# Altium schematic sheet fpga-bank6-outside.SchDoc: FPGA - Bank 6
size Letter; CheckedBy: E. Chiu; CompanyName: Brinton Engineering, LLC; DrawnBy: J. Brinton; Engineer: J. Brinton; Address1: 3479 Edison Way; Address2: Menlo Park CA 94025; Address3: +1 (877) 778-8435; Address4: brintonengineering.com; Revision: 1; SheetNumber: 13; SheetTotal: 48
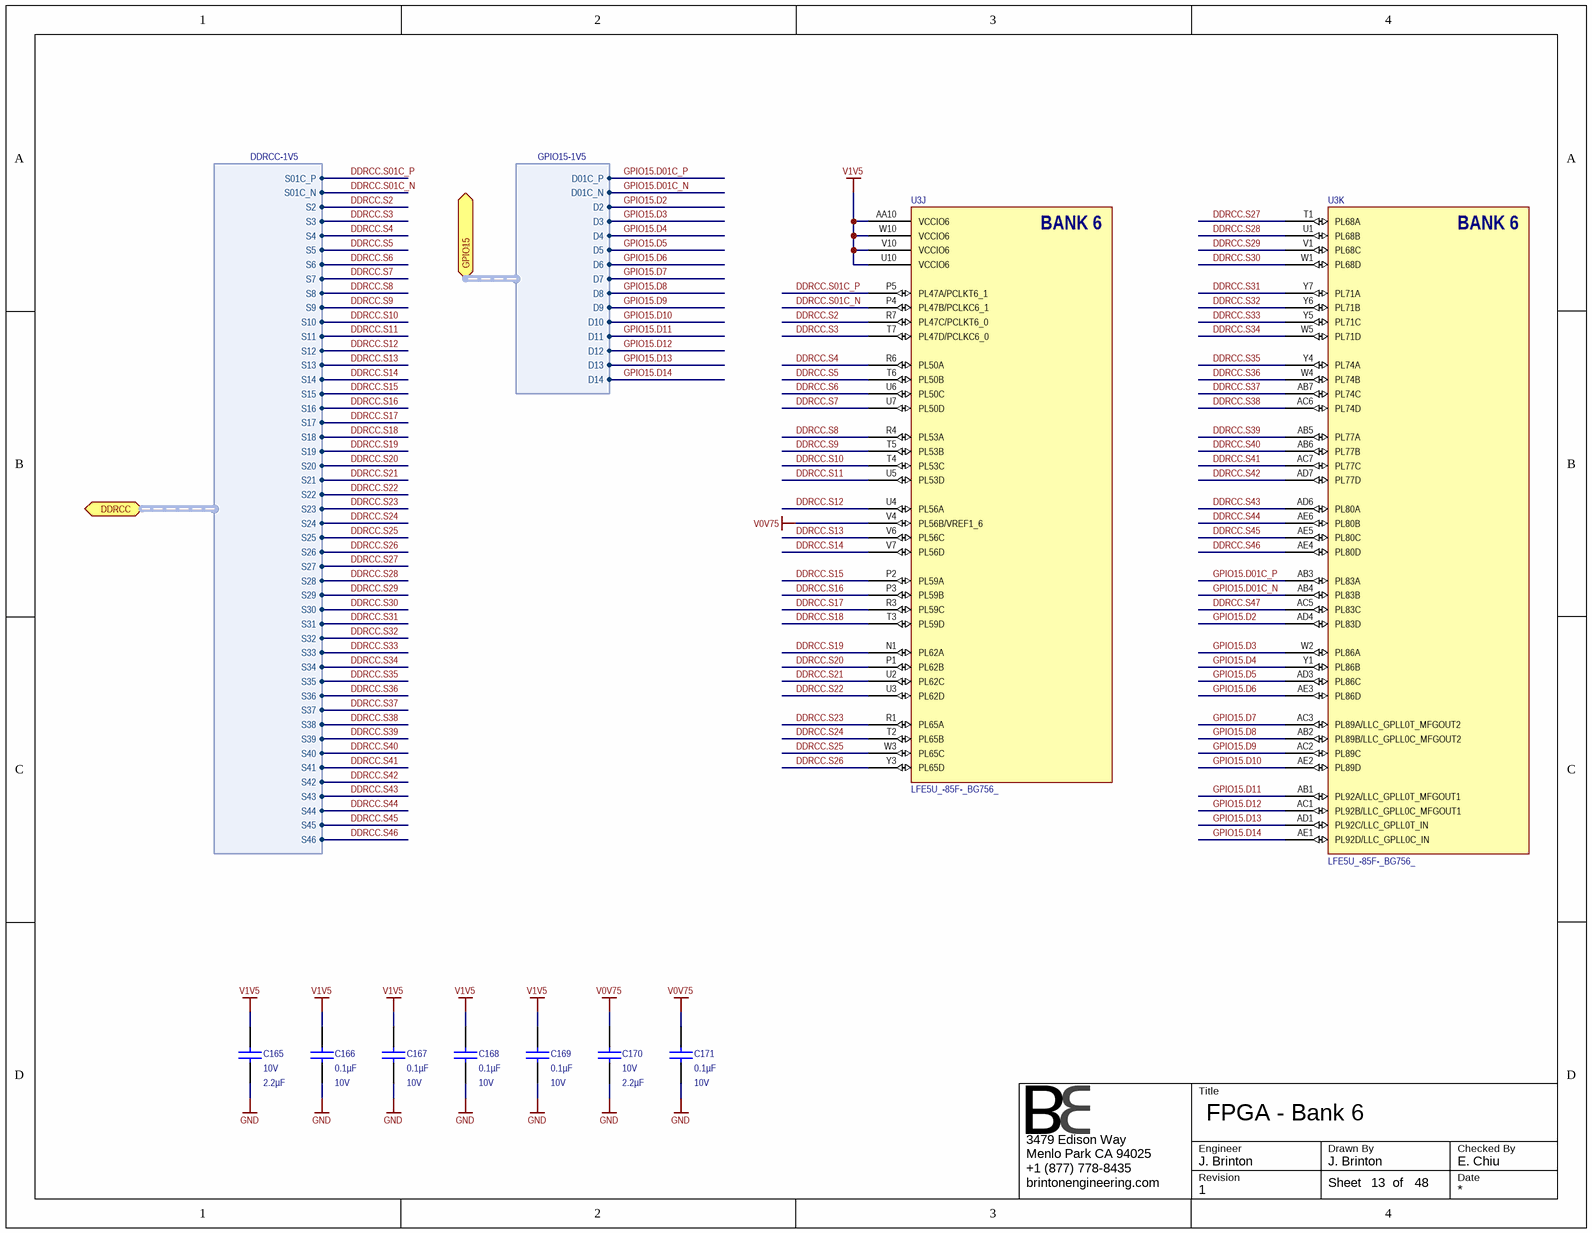
[diagram p0: fpga-bank6-outside.SchDoc]

## Parts
C165  Voltage - Rated: 10V  Capacitance: 2.2µF  [CAPC1608X90N]  (hidden comment: GRM188R71A225KE15D)
C166  Capacitance: 0.1µF  Voltage - Rated: 10V  [CAPC1005X56N]  (hidden comment: GRM155R71A104KA01J)
C167  Capacitance: 0.1µF  Voltage - Rated: 10V  [CAPC1005X56N]  (hidden comment: GRM155R71A104KA01J)
C168  Capacitance: 0.1µF  Voltage - Rated: 10V  [CAPC1005X56N]  (hidden comment: GRM155R71A104KA01J)
C169  Capacitance: 0.1µF  Voltage - Rated: 10V  [CAPC1005X56N]  (hidden comment: GRM155R71A104KA01J)
C170  Voltage - Rated: 10V  Capacitance: 2.2µF  [CAPC1608X90N]  (hidden comment: GRM188R71A225KE15D)
C171  Capacitance: 0.1µF  Voltage - Rated: 10V  [CAPC1005X56N]  (hidden comment: GRM155R71A104KA01J)
U3  LFE5U_-85F-_BG756_  [caBGA756]  (parts J,K of 19)

## Ports
DDRCC (harness DDRCC-1V5), GPIO15 (harness GPIO15-1V5)

## Harnesses
DDRCC-1V5: S01C_P, S01C_N, S2, S3, S4, S5, S6, S7, S8, S9, S10, S11, S12, S13, S14, S15, S16, S17, S18, S19, S20, S21, S22, S23, S24, S25, S26, S27, S28, S29, S30, S31, S32, S33, S34, S35, S36, S37, S38, S39, S40, S41, S42, S43, S44, S45, S46
GPIO15-1V5: D01C_P, D01C_N, D2, D3, D4, D5, D6, D7, D8, D9, D10, D11, D12, D13, D14

## Nets
GND: C165.1 C166.1 C167.1 C168.1 C169.1 C170.1 C171.1
V0V75: C170.2 C171.2 U3.V4(PL56B/VREF1_6)
V1V5: C165.2 C166.2 C167.2 C168.2 C169.2 U3.AA10(VCCIO6) U3.U10(VCCIO6) U3.V10(VCCIO6) U3.W10(VCCIO6)
DDRCC.S01C_N: U3.P4(PL47B/PCLKC6_1) ; port DDRCC.S01C_N
DDRCC.S01C_P: U3.P5(PL47A/PCLKT6_1) ; port DDRCC.S01C_P
DDRCC.S2: U3.R7(PL47C/PCLKT6_0) ; port DDRCC.S2
DDRCC.S3: U3.T7(PL47D/PCLKC6_0) ; port DDRCC.S3
DDRCC.S4: U3.R6(PL50A) ; port DDRCC.S4
DDRCC.S5: U3.T6(PL50B) ; port DDRCC.S5
DDRCC.S6: U3.U6(PL50C) ; port DDRCC.S6
DDRCC.S7: U3.U7(PL50D) ; port DDRCC.S7
DDRCC.S8: U3.R4(PL53A) ; port DDRCC.S8
DDRCC.S9: U3.T5(PL53B) ; port DDRCC.S9
DDRCC.S10: U3.T4(PL53C) ; port DDRCC.S10
DDRCC.S11: U3.U5(PL53D) ; port DDRCC.S11
DDRCC.S12: U3.U4(PL56A) ; port DDRCC.S12
DDRCC.S13: U3.V6(PL56C) ; port DDRCC.S13
DDRCC.S14: U3.V7(PL56D) ; port DDRCC.S14
DDRCC.S15: U3.P2(PL59A) ; port DDRCC.S15
DDRCC.S16: U3.P3(PL59B) ; port DDRCC.S16
DDRCC.S17: U3.R3(PL59C) ; port DDRCC.S17
DDRCC.S18: U3.T3(PL59D) ; port DDRCC.S18
DDRCC.S19: U3.N1(PL62A) ; port DDRCC.S19
DDRCC.S20: U3.P1(PL62B) ; port DDRCC.S20
DDRCC.S21: U3.U2(PL62C) ; port DDRCC.S21
DDRCC.S22: U3.U3(PL62D) ; port DDRCC.S22
DDRCC.S23: U3.R1(PL65A) ; port DDRCC.S23
DDRCC.S24: U3.T2(PL65B) ; port DDRCC.S24
DDRCC.S25: U3.W3(PL65C) ; port DDRCC.S25
DDRCC.S26: U3.Y3(PL65D) ; port DDRCC.S26
DDRCC.S27: U3.T1(PL68A) ; port DDRCC.S27
DDRCC.S28: U3.U1(PL68B) ; port DDRCC.S28
DDRCC.S29: U3.V1(PL68C) ; port DDRCC.S29
DDRCC.S30: U3.W1(PL68D) ; port DDRCC.S30
DDRCC.S31: U3.Y7(PL71A) ; port DDRCC.S31
DDRCC.S32: U3.Y6(PL71B) ; port DDRCC.S32
DDRCC.S33: U3.Y5(PL71C) ; port DDRCC.S33
DDRCC.S34: U3.W5(PL71D) ; port DDRCC.S34
DDRCC.S35: U3.Y4(PL74A) ; port DDRCC.S35
DDRCC.S36: U3.W4(PL74B) ; port DDRCC.S36
DDRCC.S37: U3.AB7(PL74C) ; port DDRCC.S37
DDRCC.S38: U3.AC6(PL74D) ; port DDRCC.S38
DDRCC.S39: U3.AB5(PL77A) ; port DDRCC.S39
DDRCC.S40: U3.AB6(PL77B) ; port DDRCC.S40
DDRCC.S41: U3.AC7(PL77C) ; port DDRCC.S41
DDRCC.S42: U3.AD7(PL77D) ; port DDRCC.S42
DDRCC.S43: U3.AD6(PL80A) ; port DDRCC.S43
DDRCC.S44: U3.AE6(PL80B) ; port DDRCC.S44
DDRCC.S45: U3.AE5(PL80C) ; port DDRCC.S45
DDRCC.S46: U3.AE4(PL80D) ; port DDRCC.S46
DDRCC.S47: U3.AC5(PL83C)
GPIO15.D01C_N: U3.AB4(PL83B) ; port GPIO15.D01C_N
GPIO15.D01C_P: U3.AB3(PL83A) ; port GPIO15.D01C_P
GPIO15.D2: U3.AD4(PL83D) ; port GPIO15.D2
GPIO15.D3: U3.W2(PL86A) ; port GPIO15.D3
GPIO15.D4: U3.Y1(PL86B) ; port GPIO15.D4
GPIO15.D5: U3.AD3(PL86C) ; port GPIO15.D5
GPIO15.D6: U3.AE3(PL86D) ; port GPIO15.D6
GPIO15.D7: U3.AC3(PL89A/LLC_GPLL0T_MFGOUT2) ; port GPIO15.D7
GPIO15.D8: U3.AB2(PL89B/LLC_GPLL0C_MFGOUT2) ; port GPIO15.D8
GPIO15.D9: U3.AC2(PL89C) ; port GPIO15.D9
GPIO15.D10: U3.AE2(PL89D) ; port GPIO15.D10
GPIO15.D11: U3.AB1(PL92A/LLC_GPLL0T_MFGOUT1) ; port GPIO15.D11
GPIO15.D12: U3.AC1(PL92B/LLC_GPLL0C_MFGOUT1) ; port GPIO15.D12
GPIO15.D13: U3.AD1(PL92C/LLC_GPLL0T_IN) ; port GPIO15.D13
GPIO15.D14: U3.AE1(PL92D/LLC_GPLL0C_IN) ; port GPIO15.D14

## Notes on the sheet
- Title
- Engineer
- Revision
- Drawn By
- Checked By
- Date
- Sheet
- of
- (in symbol LFE5U_-85F-_BG756_, part J) BANK 6
- (in symbol LFE5U_-85F-_BG756_, part K) BANK 6

## Library data of the parts
C165 C170 = GRM188R71A225KE15D: CAP CER 2.2UF 10V 10% X7R 0603; Manufacturer: Murata Electronics North America; Manufacturer P/N: GRM188R71A225KE15D; Operating Temperature: -55°C ~ 125°C; Thickness (Max): 0.035" (0.90mm); Tolerance: ±10%; Package / Case: 0603 (1608 Metric); Temperature Coefficient: X7R; Supplier 1: Newark; Supplier 2: Digi-Key; RoHS: RoHS Compliant; Size / Dimension: 0.063" L x 0.031" W (1.60mm x 0.80mm); Mounting Type: Surface Mount, MLCC; ComponentLink1URL: http://www.murata.com/~/media/webrenewal/support/library/catalog/products/capacitor/mlcc/c02e.ashx; ComponentLink1Description: http://www.murata.com/~/media/webrenewal/support/library/catalog/products/capacitor/mlcc/c02e.ashx; Supplier Part Number 1: 72R4209; Supplier Part Number 2: 490-4520-1-ND
C166-C169 C171 = GRM155R71A104KA01J: CAP CER 0.1UF 10V 10% X7R 0402; Manufacturer: Murata Electronics North America; Manufacturer P/N: GRM155R71A104KA01J; Operating Temperature: -55°C ~ 125°C; Thickness (Max): 0.022" (0.55mm); Size / Dimension: 0.039" L x 0.020" W (1.00mm x 0.50mm); RoHS: RoHS Compliant; Mounting Type: Surface Mount, MLCC; Supplier 1: Digi-Key; ComponentLink1URL: http://www.murata.com/~/media/webrenewal/support/library/catalog/products/capacitor/mlcc/c02e.ashx; ComponentLink1Description: http://www.murata.com/~/media/webrenewal/support/library/catalog/products/capacitor/mlcc/c02e.ashx; Supplier Part Number 1: 490-6322-1-ND; Temperature Coefficient: X7R; Package / Case: 0402 (1005 Metric); Tolerance: ±10%
U3 = LFE5U_-85F-_BG756_: ECP5 FPGA, 85k LUT, 756-caBGA; Manufacturer: Lattice Semiconductor; Manufacturer P/N: LFE5U_-85F-_BG756_